# EAGLE design oplab_pth (EAGLE 9.4.2)

## Sheet 1 of 3
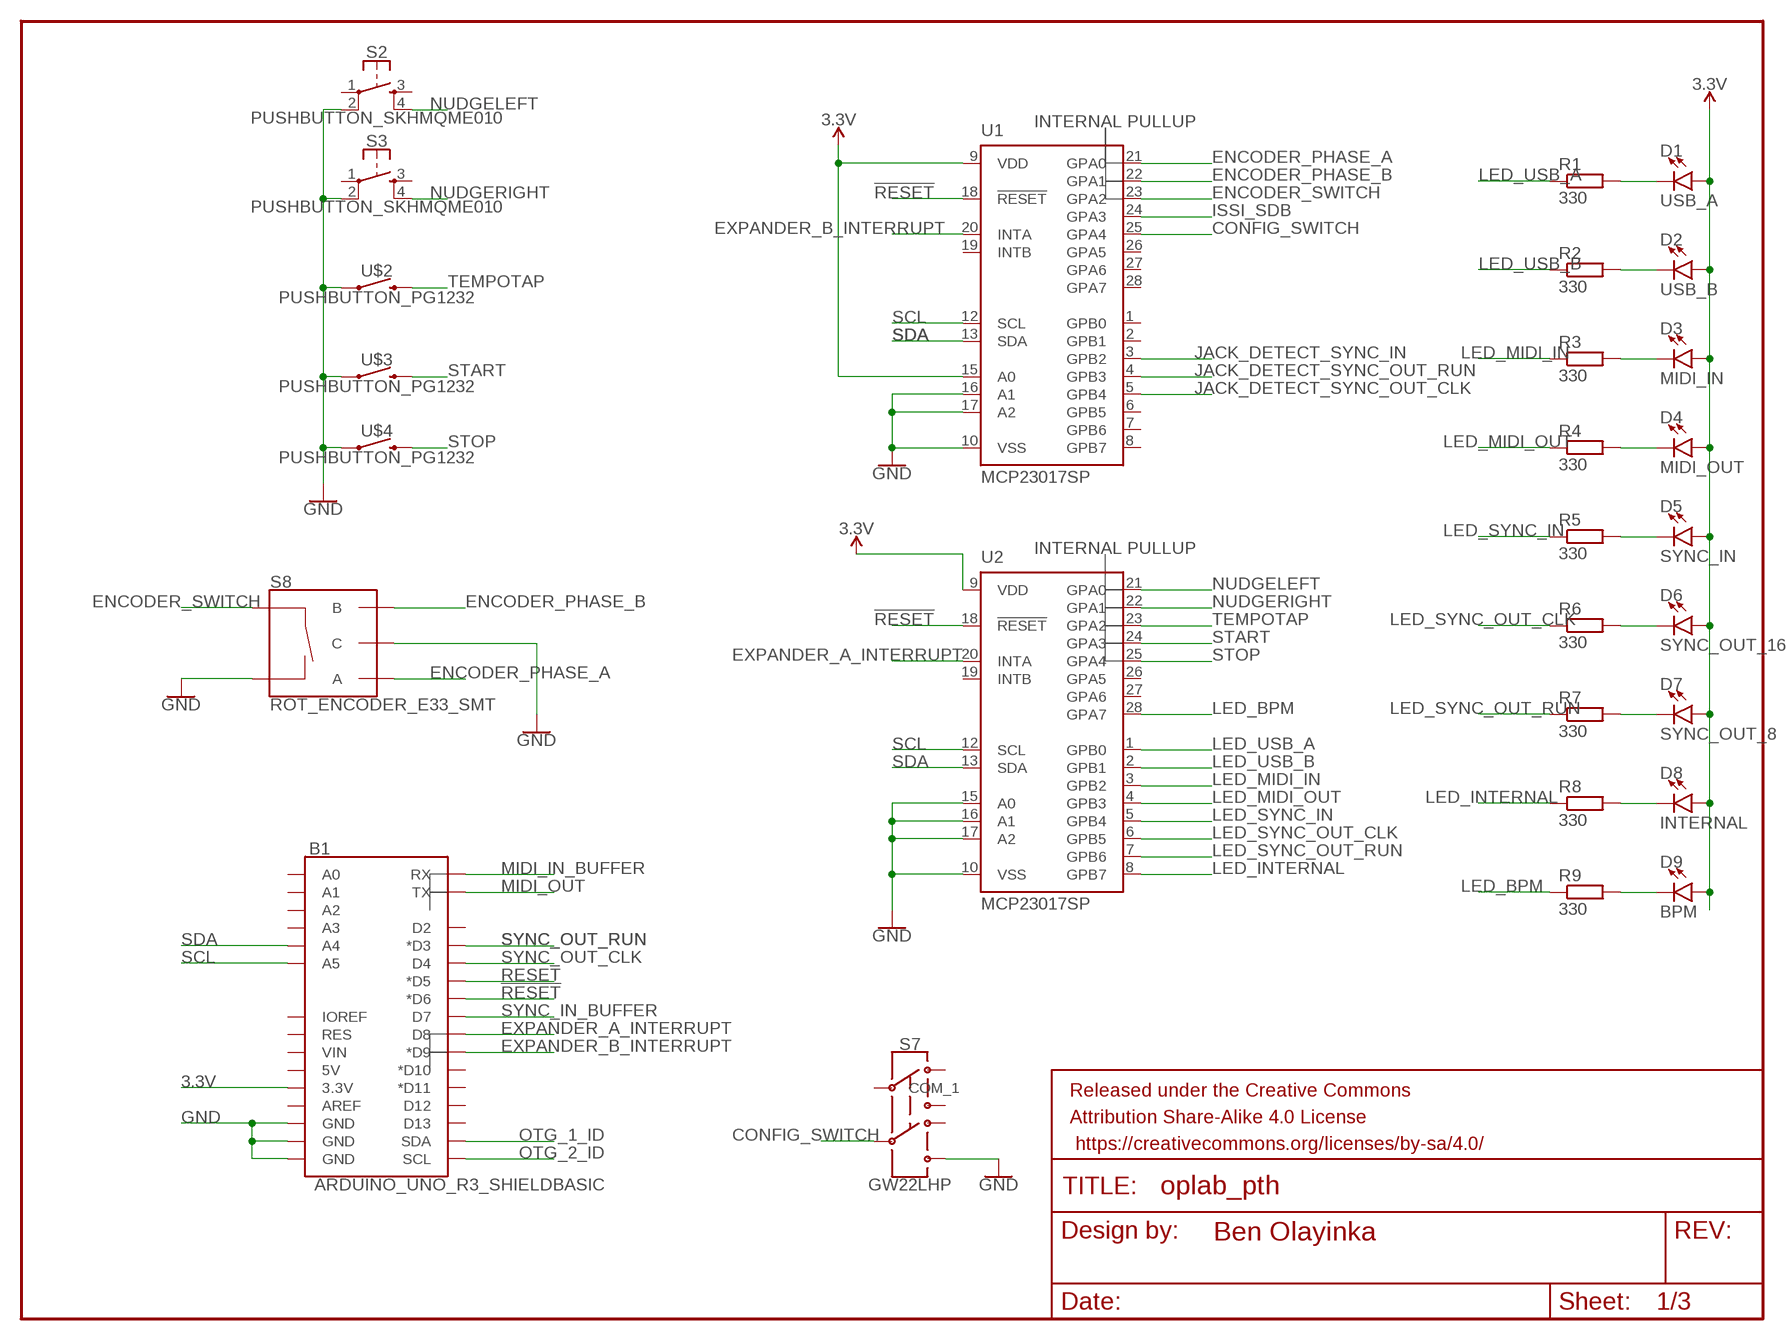
[diagram p0: schematic, sheet 1]

### Parts
B1  ARDUINO_UNO_R3_SHIELDBASIC  [UNO_R3_SHIELD]
D1  USB_A  LED5MM  [LED_5MM]
D2  USB_B  LED5MM  [LED_5MM]
D3  MIDI_IN  LED5MM  [LED_5MM]
D4  MIDI_OUT  LED5MM  [LED_5MM]
D5  SYNC_IN  LED5MM  [LED_5MM]
D6  SYNC_OUT_16  LED5MM  [LED_5MM]
D7  SYNC_OUT_8  LED5MM  [LED_5MM]
D8  INTERNAL  LED5MM  [LED_5MM]
D9  BPM  LED5MM  [LED_5MM]
FRAME1  FRAME-LETTERNO_PACKAGE  [DUMMY]
R1  330  R-EU_0207/10  [0207/10]
R2  330  R-EU_0207/10  [0207/10]
R3  330  R-EU_0207/10  [0207/10]
R4  330  R-EU_0207/10  [0207/10]
R5  330  R-EU_0207/10  [0207/10]
R6  330  R-EU_0207/10  [0207/10]
R7  330  R-EU_0207/10  [0207/10]
R8  330  R-EU_0207/10  [0207/10]
R9  330  R-EU_0207/10  [0207/10]
S2  PUSHBUTTON_SKHMQME010  [PUSHUTTON_SKHMQLE010]
S3  PUSHBUTTON_SKHMQME010  [PUSHUTTON_SKHMQLE010]
S7  GW22LHP  [GW22LHP]
S8  ROT_ENCODER_E33_SMT  [ROT_ENCODER_E33_SMT]
U1  MCP23017SP  [DIL28-3]
U2  MCP23017SP  [DIL28-3]
U$2  PUSHBUTTON_PG1232  [PUSHBUTTON_PG1232]
U$3  PUSHBUTTON_PG1232  [PUSHBUTTON_PG1232]
U$4  PUSHBUTTON_PG1232  [PUSHBUTTON_PG1232]

### Nets
3.3V: B1.3.3V D1.A D2.A D3.A D4.A D5.A D6.A D7.A D8.A D9.A U1.9(VDD) U1.15(A0) U2.9(VDD) ; also sheet 2
!RESET: B1.D6(*D6) U1.18(!RESET) U2.18(!RESET)
CONFIG_SWITCH: S7.5(COM_2) U1.25(GPA4)
ENCODER_PHASE_A: S8.A U1.21(GPA0)
ENCODER_PHASE_B: S8.B U1.22(GPA1)
ENCODER_SWITCH: S8.S1(SW+) U1.23(GPA2)
EXPANDER_A_INTERRUPT: B1.D8 U2.20(INTA)
EXPANDER_B_INTERRUPT: B1.D9(*D9) U1.20(INTA)
GND: B1.GND@0(GND) B1.GND@1(GND) B1.GND@2(GND) S2.2 S3.2 S7.4(NO_2) S8.C S8.S2(SW-) U1.10(VSS) U1.16(A1) U1.17(A2) U2.10(VSS) U2.15(A0) U2.16(A1) U2.17(A2) U$2.1 U$3.1 U$4.1 ; also sheet 2
ISSI_SDB: U1.24(GPA3) ; also sheet 2
JACK_DETECT_SYNC_IN: U1.3(GPB2) ; also sheet 2
JACK_DETECT_SYNC_OUT_CLK: U1.5(GPB4) ; also sheet 2
JACK_DETECT_SYNC_OUT_RUN: U1.4(GPB3) ; also sheet 2
LED_BPM: R9.1 U2.28(GPA7)
LED_INTERNAL: R8.1 U2.8(GPB7)
LED_MIDI_IN: R3.1 U2.3(GPB2)
LED_MIDI_OUT: R4.1 U2.4(GPB3)
LED_SYNC_IN: R5.1 U2.5(GPB4)
LED_SYNC_OUT_CLK: R6.1 U2.6(GPB5)
LED_SYNC_OUT_RUN: R7.1 U2.7(GPB6)
LED_USB_A: R1.1 U2.1(GPB0)
LED_USB_B: R2.1 U2.2(GPB1)
MIDI_IN_BUFFER: B1.RX ; also sheet 2
MIDI_OUT: B1.TX ; also sheet 2
N$1: D1.K(C) R1.2
N$2: D2.K(C) R2.2
N$3: D3.K(C) R3.2
N$4: D4.K(C) R4.2
N$5: D5.K(C) R5.2
N$6: D6.K(C) R6.2
N$7: D7.K(C) R7.2
N$9: D8.K(C) R8.2
N$10: D9.K(C) R9.2
NUDGELEFT: S2.4 U2.21(GPA0)
NUDGERIGHT: S3.4 U2.22(GPA1)
OTG_1_ID: B1.SDA
OTG_2_ID: B1.SCL
RESET: B1.D5(*D5) ; also sheet 2
SCL: B1.A5 U1.12(SCL) U2.12(SCL) ; also sheet 2
SDA: B1.A4 U1.13(SDA) U2.13(SDA) ; also sheet 2
START: U2.24(GPA3) U$3.2
STOP: U2.25(GPA4) U$4.2
SYNC_IN_BUFFER: B1.D7 ; also sheet 2
SYNC_OUT_CLK: B1.D4 ; also sheet 2
SYNC_OUT_RUN: B1.D3(*D3) ; also sheet 2
TEMPOTAP: U2.23(GPA2) U$2.2
Unconnected: B1.5V B1.A0 B1.A1 B1.A2 B1.A3 B1.AREF B1.D2 B1.D10(*D10) B1.D11(*D11) B1.D12 B1.D13 B1.IOREF B1.RES B1.VIN S2.1 S2.3 S3.1 S3.3 S7.1(NO_1) S7.2(COM_1) S7.3(NC_1) S7.6(NC_2) U1.1(GPB0) U1.2(GPB1) U1.6(GPB5) U1.7(GPB6) U1.8(GPB7) U1.19(INTB) U1.26(GPA5) U1.27(GPA6) U1.28(GPA7) U2.19(INTB) U2.26(GPA5) U2.27(GPA6)

### Notes on the sheet
- INTERNAL PULLUP
- INTERNAL PULLUP

## Sheet 2 of 3
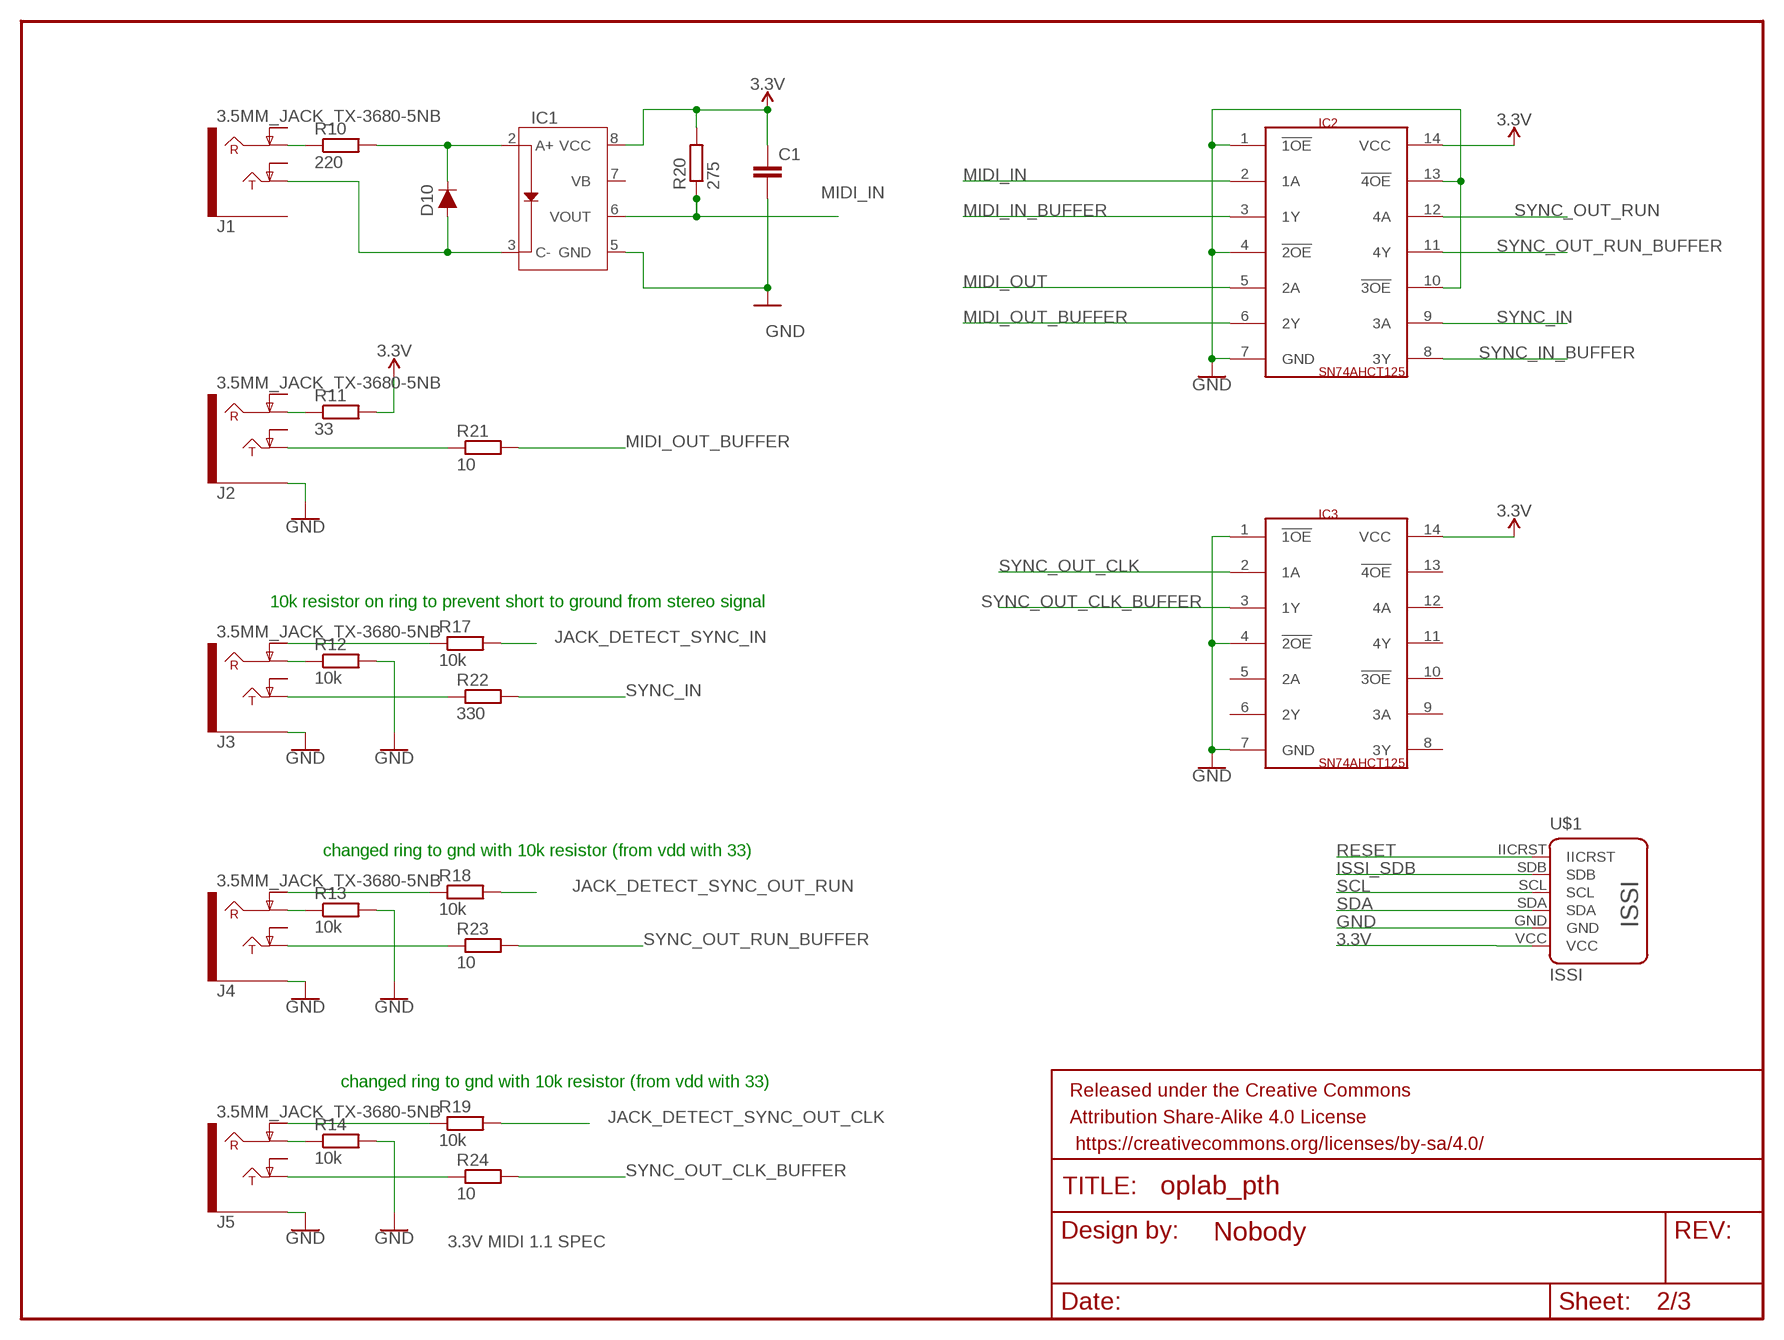
[diagram p1: schematic, sheet 2]

### Parts
C1  C-EU025-024X044  [C025-024X044]
D10  200mA/100V/1V  DIODE-1N4148  [DIODE-1N4148]
FRAME2  FRAME-LETTERNO_PACKAGE  [DUMMY]
IC1  OPTO_DARLINGTON_HCPL0701  [OPTO_DARLINGTON_SOIC127P594X363-8N]
IC2  SN74AHCT125  [SN74AHCT_DIP794W53P254L1930H508Q14N]
IC3  SN74AHCT125  [SN74AHCT_DIP794W53P254L1930H508Q14N]
J1  3.5MM_JACK_TX-3680-5NB  [3.5MM_JACK_TX36805NB]
J2  3.5MM_JACK_TX-3680-5NB  [3.5MM_JACK_TX36805NB]
J3  3.5MM_JACK_TX-3680-5NB  [3.5MM_JACK_TX36805NB]
J4  3.5MM_JACK_TX-3680-5NB  [3.5MM_JACK_TX36805NB]
J5  3.5MM_JACK_TX-3680-5NB  [3.5MM_JACK_TX36805NB]
R10  220  R-EU_0207/10  [0207/10]
R11  33  R-EU_0207/10  [0207/10]
R12  10k  R-EU_0207/10  [0207/10]
R13  10k  R-EU_0207/10  [0207/10]
R14  10k  R-EU_0207/10  [0207/10]
R17  10k  R-EU_0207/10  [0207/10]
R18  10k  R-EU_0207/10  [0207/10]
R19  10k  R-EU_0207/10  [0207/10]
R20  275  R-EU_0207/10  [0207/10]
R21  10  R-EU_0207/10  [0207/10]
R22  330  R-EU_0207/10  [0207/10]
R23  10  R-EU_0207/10  [0207/10]
R24  10  R-EU_0207/10  [0207/10]
U$1  ISSI  [ISSI]

### Nets
3.3V: C1.1 IC1.8(VCC) IC2.14(VCC) IC3.14(VCC) R11.2 R20.2 U$1.VCC ; also sheet 1
GND: C1.2 IC1.5(GND) IC2.1(!1OE) IC2.4(!2OE) IC2.7(GND) IC2.10(!3OE) IC2.13(!4OE) IC3.1(!1OE) IC3.4(!2OE) IC3.7(GND) J2.1.EARTH(EARTH) J3.1.EARTH(EARTH) J4.1.EARTH(EARTH) J5.1.EARTH(EARTH) R12.2 R13.2 R14.2 U$1.GND ; also sheet 1
ISSI_SDB: U$1.SDB ; also sheet 1
JACK_DETECT_SYNC_IN: R17.2 ; also sheet 1
JACK_DETECT_SYNC_OUT_CLK: R19.2 ; also sheet 1
JACK_DETECT_SYNC_OUT_RUN: R18.2 ; also sheet 1
MIDI_IN: IC1.6(VOUT) IC2.2(1A) R20.1
MIDI_IN_BUFFER: IC2.3(1Y) ; also sheet 1
MIDI_OUT: IC2.5(2A) ; also sheet 1
MIDI_OUT_BUFFER: IC2.6(2Y) R21.2
N$8: D10.C IC1.2(A+) R10.2
N$11: D10.A IC1.3(C-) J1.2.TIP(TIP)
N$12: J1.3.RING(RING) R10.1
N$13: J2.3.RING(RING) R11.1
N$14: J3.3.RING(RING) R12.1
N$15: J4.3.RING(RING) R13.1
N$16: J5.3.RING(RING) R14.1
N$21: J2.2.TIP(TIP) R21.1
N$23: J3.2.TIP(TIP) R22.1
N$25: J4.2.TIP(TIP) R23.1
N$27: J5.2.TIP(TIP) R24.1
N$32: J3.5.RINGNORM(RING-NORM) R17.1
N$33: J4.5.RINGNORM(RING-NORM) R18.1
N$34: J5.5.RINGNORM(RING-NORM) R19.1
RESET: U$1.IICRST ; also sheet 1
SCL: U$1.SCL ; also sheet 1
SDA: U$1.SDA ; also sheet 1
SYNC_IN: IC2.9(3A) R22.2
SYNC_IN_BUFFER: IC2.8(3Y) ; also sheet 1
SYNC_OUT_CLK: IC3.2(1A) ; also sheet 1
SYNC_OUT_CLK_BUFFER: IC3.3(1Y) R24.2
SYNC_OUT_RUN: IC2.12(4A) ; also sheet 1
SYNC_OUT_RUN_BUFFER: IC2.11(4Y) R23.2
Unconnected: IC1.7(VB) IC3.5(2A) IC3.6(2Y) IC3.8(3Y) IC3.9(3A) IC3.10(!3OE) IC3.11(4Y) IC3.12(4A) IC3.13(!4OE) J1.1.EARTH(EARTH) J1.4.TIPNORM(TIP-NORM) J1.5.RINGNORM(RING-NORM) J2.4.TIPNORM(TIP-NORM) J2.5.RINGNORM(RING-NORM) J3.4.TIPNORM(TIP-NORM) J4.4.TIPNORM(TIP-NORM) J5.4.TIPNORM(TIP-NORM)

### Notes on the sheet
- 10k resistor on ring to prevent short to ground from stereo signal
- changed ring to gnd with 10k resistor (from vdd with 33)
- changed ring to gnd with 10k resistor (from vdd with 33)
- 3.3V MIDI 1.1 SPEC

## Sheet 3 of 3
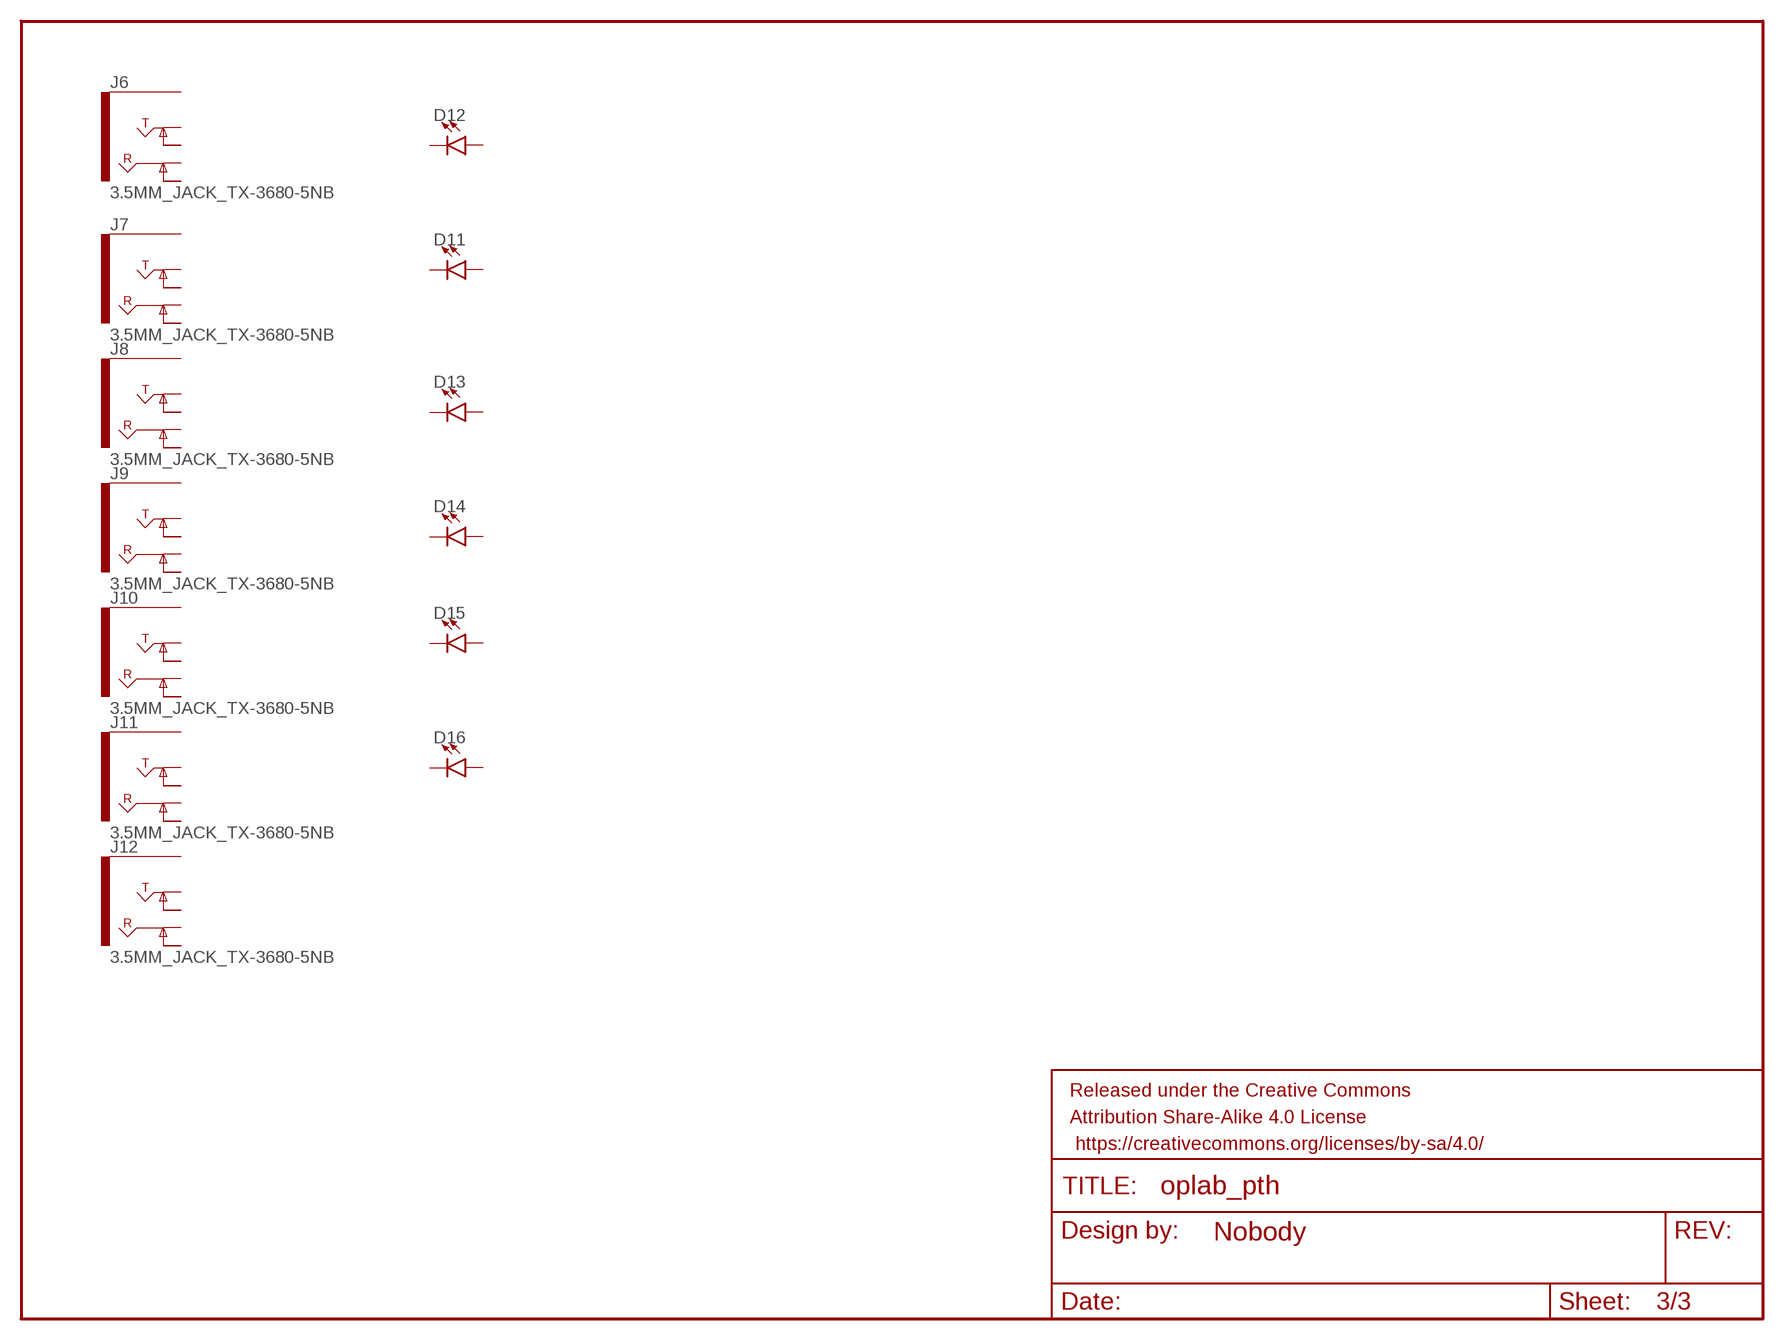
[diagram p2: schematic, sheet 3]

### Parts
D11  LED5MM  [LED_5MM]
D12  LED5MM  [LED_5MM]
D13  LED5MM  [LED_5MM]
D14  LED5MM  [LED_5MM]
D15  LED5MM  [LED_5MM]
D16  LED5MM  [LED_5MM]
FRAME3  FRAME-LETTERNO_PACKAGE  [DUMMY]
J6  3.5MM_JACK_TX-3680-5NB  [3.5MM_JACK_TX36805NB]
J7  3.5MM_JACK_TX-3680-5NB  [3.5MM_JACK_TX36805NB]
J8  3.5MM_JACK_TX-3680-5NB  [3.5MM_JACK_TX36805NB]
J9  3.5MM_JACK_TX-3680-5NB  [3.5MM_JACK_TX36805NB]
J10  3.5MM_JACK_TX-3680-5NB  [3.5MM_JACK_TX36805NB]
J11  3.5MM_JACK_TX-3680-5NB  [3.5MM_JACK_TX36805NB]
J12  3.5MM_JACK_TX-3680-5NB  [3.5MM_JACK_TX36805NB]
Unconnected: D11.A D11.K(C) D12.A D12.K(C) D13.A D13.K(C) D14.A D14.K(C) D15.A D15.K(C) D16.A D16.K(C) J6.1.EARTH(EARTH) J6.2.TIP(TIP) J6.3.RING(RING) J6.4.TIPNORM(TIP-NORM) J6.5.RINGNORM(RING-NORM) J7.1.EARTH(EARTH) J7.2.TIP(TIP) J7.3.RING(RING) J7.4.TIPNORM(TIP-NORM) J7.5.RINGNORM(RING-NORM) J8.1.EARTH(EARTH) J8.2.TIP(TIP) J8.3.RING(RING) J8.4.TIPNORM(TIP-NORM) J8.5.RINGNORM(RING-NORM) J9.1.EARTH(EARTH) J9.2.TIP(TIP) J9.3.RING(RING) J9.4.TIPNORM(TIP-NORM) J9.5.RINGNORM(RING-NORM) J10.1.EARTH(EARTH) J10.2.TIP(TIP) J10.3.RING(RING) J10.4.TIPNORM(TIP-NORM) J10.5.RINGNORM(RING-NORM) J11.1.EARTH(EARTH) J11.2.TIP(TIP) J11.3.RING(RING) J11.4.TIPNORM(TIP-NORM) J11.5.RINGNORM(RING-NORM) J12.1.EARTH(EARTH) J12.2.TIP(TIP) J12.3.RING(RING) J12.4.TIPNORM(TIP-NORM) J12.5.RINGNORM(RING-NORM)

## Library data of the parts
B1 = SparkFun-Boards:ARDUINO_UNO_R3_SHIELD: Arduino R3 Shield Footprint Shield form compatible with the Arduino Uno R3. SparkFun Products: MG2639 Cellular Shield <https://www.sparkfun.com/products/13120> MIDI Shield <https://www.sparkfun.com/products/12898> R3 Stackable Headers Kit <https://www.sparkfun.com/products/11417>
C1 = rcl:C-EU: CAPACITOR, European symbol; SPICEPREFIX: C
D1-D9 D11-D16 = SparkFun-LED:LED: LED (Generic) Standard schematic elements and footprints for 5mm, 3mm, 1206, and 0603 sized LEDs. Generic LEDs with no color specified.
D10 = SparkFun-DiscreteSemi:DIODE: Diode These are standard reverse protection diodes and small signal diodes. SparkFun Products: SparkFun SparkPunk Sound Kit <https://www.sparkfun.com/products/11177> SparkFun ESP8266 Thing <https://www.sparkfun.com/products/13231>; PROD_ID: DIO-08378
FRAME1 = SparkFun-Aesthetics:FRAME-LETTER: Schematic Frame - Letter Standard 8.5x11 US Letter frame; DESIGNER: Ben Olayinka; VERSION: v01
FRAME2 FRAME3 = SparkFun-Aesthetics:FRAME-LETTER: Schematic Frame - Letter Standard 8.5x11 US Letter frame; DESIGNER: Nobody; VERSION: v01
IC1 = SamacSys_Parts:OPTO_DARLINGTON_HCPL0701: Hi-Gain Split Darlington Optocoupler SO8 Source: Datasheet <http://www.onsemi.com/pub/Collateral/HCPL0731-D.pdf>; DESCRIPTION: Hi-Gain Split Darlington Optocoupler SO8; HEIGHT: 3.63mm; MANUFACTURER_NAME: ON Semiconductor; MANUFACTURER_PART_NUMBER: HCPL0701; MOUSER_PART_NUMBER: 512-HCPL0701; MOUSER_PRICE-STOCK: https://www.mouser.com/Search/Refine.aspx?Keyword=512-HCPL0701; RS_PART_NUMBER: 9034263P; RS_PRICE-STOCK: http://uk.rs-online.com/web/p/products/9034263P
IC2 IC3 = SamacSys_Parts:SN74AHCT125: sn74ahct125n Quadruple Bus Buffer Gates With 3 State Outputs https://www.ti.com/lit/ds/symlink/sn74ahct125.pdf; DESCRIPTION: Hex Schmitt Trigger Inverter SN74HCT14N; HEIGHT: 5.08mm; MANUFACTURER_NAME: Texas Instruments; MANUFACTURER_PART_NUMBER: SN74HCT14N; MOUSER_PART_NUMBER: 595-SN74HCT14N; MOUSER_PRICE-STOCK: https://www.mouser.com/Search/Refine.aspx?Keyword=595-SN74HCT14N; RS_PART_NUMBER: 0526331; RS_PRICE-STOCK: http://uk.rs-online.com/web/p/products/0526331
J1-J12 = SamacSys_Parts:3.5MM_JACK_TX-3680-5NB
R1-R14 R17-R24 = rcl:R-EU_: RESISTOR, European symbol; SPICEPREFIX: R
S2 S3 = SamacSys_Parts:PUSHBUTTON_SKHMQME010
S7 = SamacSys_Parts:GW22LHP: NKK SWITCHES - GW22LHP - ROCKER SWITCH, DPDT, ON-ON Source: Datasheet <https://www.nkkswitches.com/pdf/GW.pdf>; ALLIED_NUMBER: 70365614; ALLIED_PRICE-STOCK: https://www.alliedelec.com/nkkswitches-gw22lhp/70365614/; DESCRIPTION: NKK SWITCHES - GW22LHP - ROCKER SWITCH, DPDT, ON-ON; HEIGHT: 10.8mm; MANUFACTURER_NAME: NKK Switches; MANUFACTURER_PART_NUMBER: GW22LHP; MOUSER_PART_NUMBER: 633-GW22LHP; MOUSER_PRICE-STOCK: https://www.mouser.com/Search/Refine.aspx?Keyword=633-GW22LHP
S8 = SamacSys_Parts:ROT_ENCODER_E33_SMT: Rotary Switch 16Pos, E33-VT632-M11T, Elma Source: Datasheet <https://www.distrelec.de/en/rotary-switch-16pos-elma-e33-vt632-m11t/p/13584701?utm_source=octoX&utm_medium=cse&utm_campaign=octo-feed&ext_cid=ceoctaqzzen-na>
U1 U2 = adafruit:MCP23017: http://ww1.microchip.com/downloads/en/DeviceDoc/21952a.pdf Source: http://ww1.microchip.com/downloads/en/DeviceDoc/21952a.pdf
U$1 = SamacSys_Parts:ISSI
U$2-U$4 = SamacSys_Parts:PUSHBUTTON_PG1232

## Board
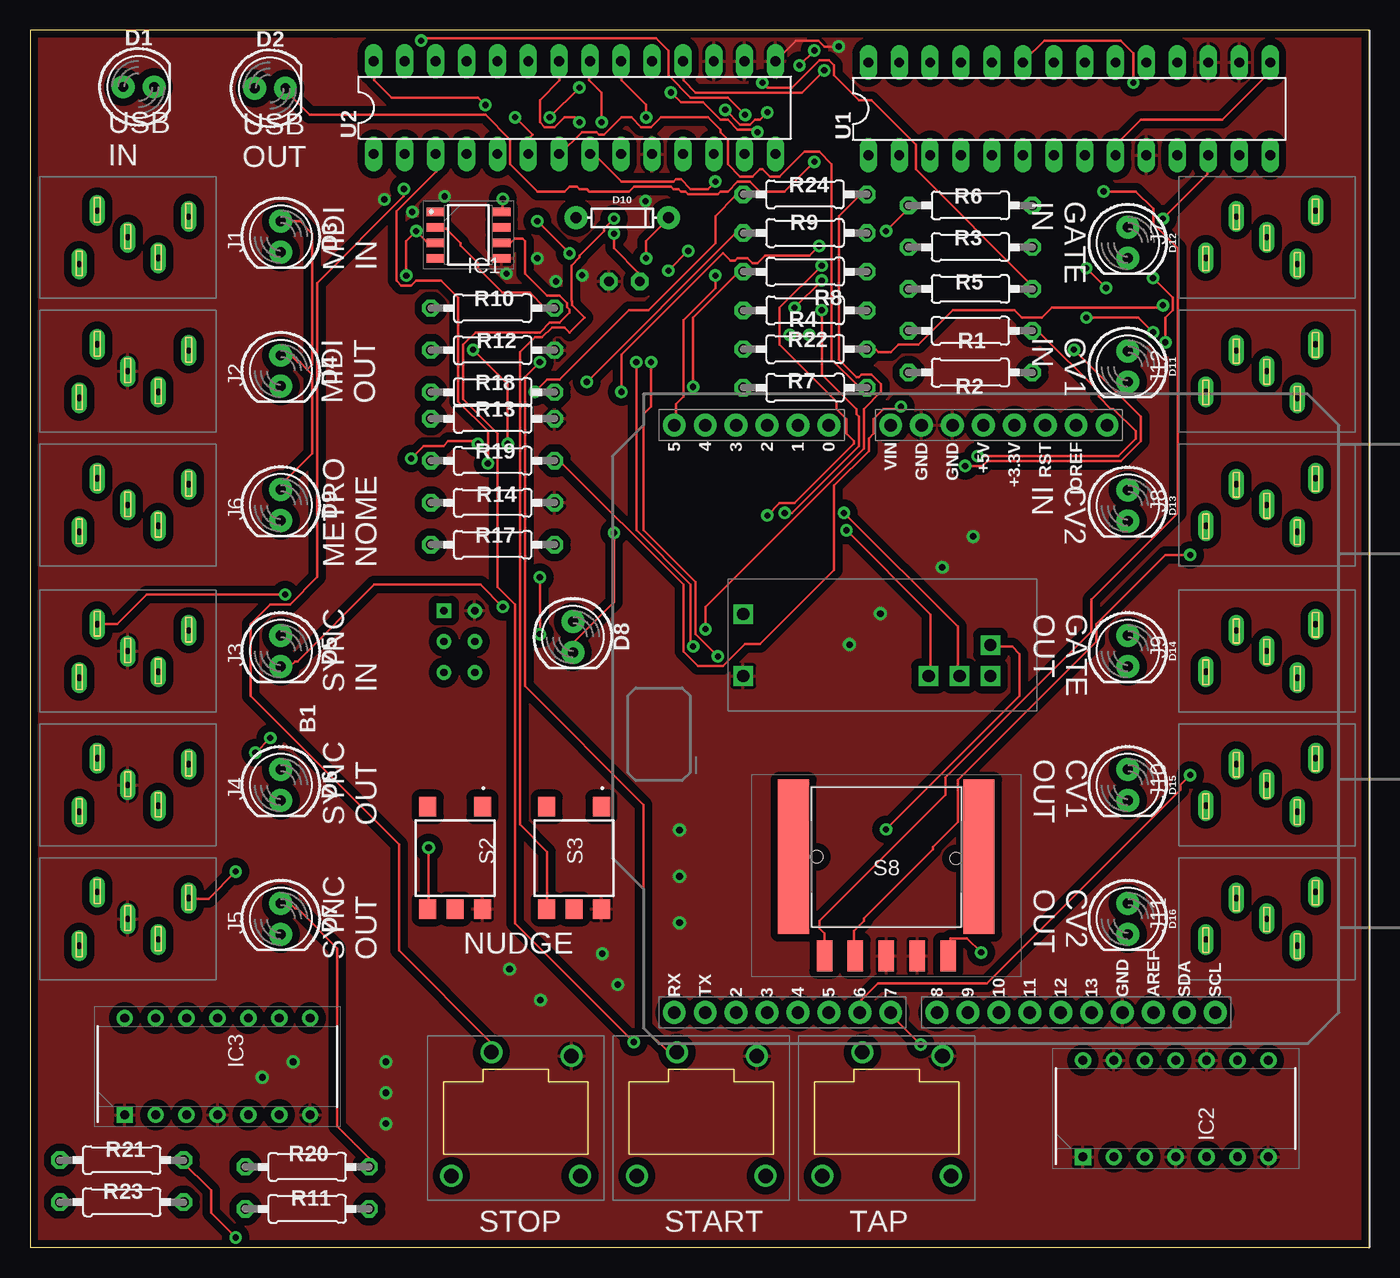
[diagram p3: board, top side]
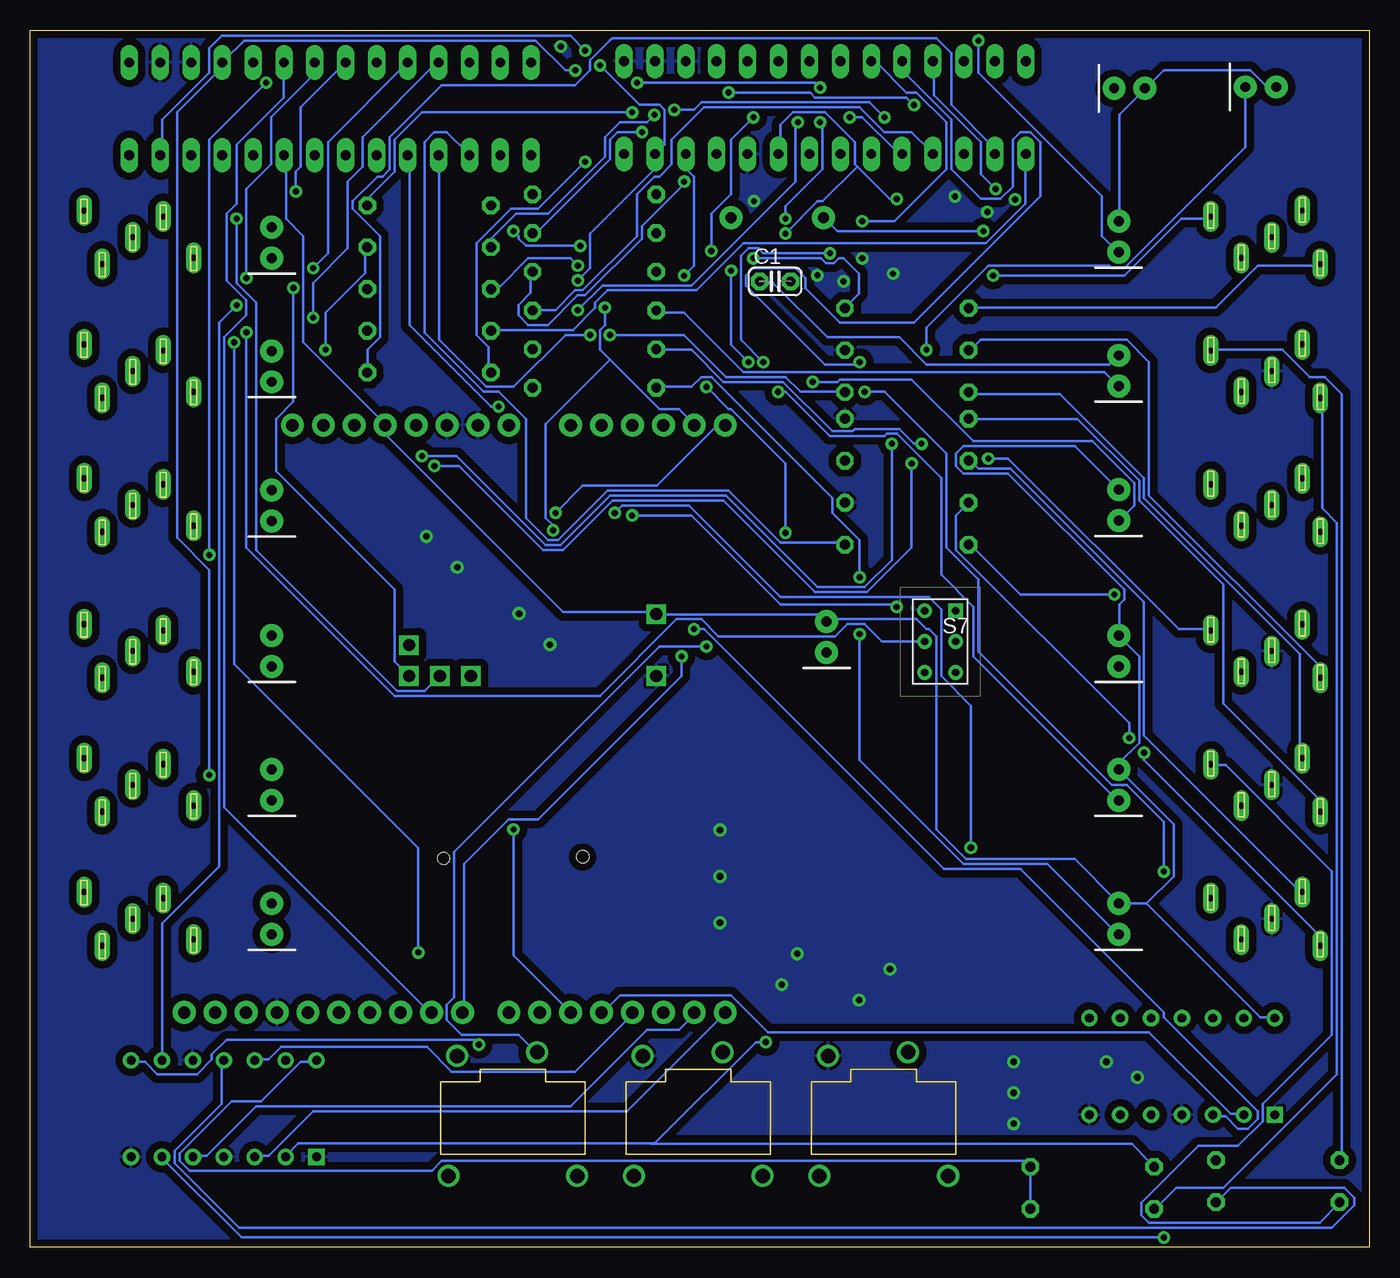
[diagram p4: board, bottom side, seen from below]

Size 110 x 100 mm. Coordinates in mm from the lower left corner, seen from the top.
Outline: 0,0 25,0 110,0 110,100 25,100 0,100 0,0
Copper layers (1*16): Top 0.035mm / dielectric 1.5mm / Bottom 0.035mm
Design rules "SparkFun": minimum track width 8mil, minimum drill 20mil, track to track 8mil, track to pad 8mil, pad to pad 8mil, via to via 8mil, smd to smd 8mil, copper to edge 8mil, drill to drill 8mil, minimum pad ring 12mil, minimum via ring 10mil, stop-mask expansion 4mil, vias tented up to drill 20mil, thermal gap 10mil

### Footprints (pad centres in the part's own frame; a part is rotated, then mirrored left to right if it is on the bottom)
UNO_R3_SHIELD = drill 1.016 pad 1.88: 3.3V 24.13,-2.54; 5V 24.13,0; A0 24.13,12.7; A1 24.13,15.24; A2 24.13,17.78; A3 24.13,20.32; A4 24.13,22.86; A5 24.13,25.4; AREF -24.13,-13.97; D2 -24.13,20.32; D3 -24.13,17.78; D4 -24.13,15.24; D5 -24.13,12.7; D6 -24.13,10.16; D7 -24.13,7.62; D8 -24.13,3.81; D9 -24.13,1.27; D10 -24.13,-1.27; D11 -24.13,-3.81; D12 -24.13,-6.35; D13 -24.13,-8.89; GND@0 24.13,2.54; GND@1 24.13,5.08; GND@2 -24.13,-11.43; IOREF 24.13,-7.62; NC 24.13,-10.16; RES 24.13,-5.08; RX -24.13,25.4; SCL -24.13,-19.05; SDA -24.13,-16.51; TX -24.13,22.86; VIN 24.13,7.62
C025-024X044 = drill 0.813 octagon: 1 -1.27,0; 2 1.27,0
LED_5MM = drill 0.813 pad 1.88: A -1.27,0; K 1.27,0
DIODE-1N4148 = drill 0.9 pad 1.88: A -3.81,0; C 3.81,0
OPTO_DARLINGTON_SOIC127P594X363-8N = smd 1.45 x 0.7: 1 -2.725,1.905; 2 -2.725,0.635; 3 -2.725,-0.635; 4 -2.725,-1.905; 5 2.725,-1.905; 6 2.725,-0.635; 7 2.725,0.635; 8 2.725,1.905
SN74AHCT_DIP794W53P254L1930H508Q14N = drill 0.73 pad 1.13 square: 1 -3.97,7.62 | drill 0.73 pad 1.13: 2 -3.97,5.08; 3 -3.97,2.54; 4 -3.97,0; 5 -3.97,-2.54; 6 -3.97,-5.08; 7 -3.97,-7.62; 8 3.97,-7.62; 9 3.97,-5.08; 10 3.97,-2.54; 11 3.97,0; 12 3.97,2.54; 13 3.97,5.08; 14 3.97,7.62
3.5MM_JACK_TX36805NB = drill 0.508 pad 1.27 long: 1.EARTH 0,0; 2.TIP -1.7,5; 3.RING 2.2,-4; 4.TIPNORM 1.7,2.5; 5.RINGNORM -2.2,-2.5
0207/10 = drill 0.813 octagon: 1 -5.08,0; 2 5.08,0
PUSHUTTON_SKHMQLE010 = smd 1.6 x 1.4: 1 -4.2,2.25; 2 4.2,2.25; 3 -4.2,-2.25; 4 4.2,-2.25; 5 4.2,0
GW22LHP = drill 0.6 pad 1 square: 1 0,0 | drill 0.6 pad 1: 2 0,-2.54; 3 0,-5.08; 4 -2.54,0; 5 -2.54,-2.54; 6 -2.54,-5.08
ROT_ENCODER_E33_SMT = smd 1.27 x 2.54: A 5.08,-8.128; B -5.08,-8.128; C 2.54,-8.128; S1 -2.54,-8.128; S2 0,-8.128 | smd 2.54 x 12.7: P$6 -7.62,0; P$8 7.62,0 | hole 1: -5.715,0; 5.715,-0.127
DIL28-3 = drill 0.813 long: 1 -16.51,-3.81; 2 -13.97,-3.81; 3 -11.43,-3.81; 4 -8.89,-3.81; 5 -6.35,-3.81; 6 -3.81,-3.81; 7 -1.27,-3.81; 8 1.27,-3.81; 9 3.81,-3.81; 10 6.35,-3.81; 11 8.89,-3.81; 12 11.43,-3.81; 13 13.97,-3.81; 14 16.51,-3.81; 15 16.51,3.81; 16 13.97,3.81; 17 11.43,3.81; 18 8.89,3.81; 19 6.35,3.81; 20 3.81,3.81; 21 1.27,3.81; 22 -1.27,3.81; 23 -3.81,3.81; 24 -6.35,3.81; 25 -8.89,3.81; 26 -11.43,3.81; 27 -13.97,3.81; 28 -16.51,3.81
ISSI = drill 1 square: GND -11.43,-2.54; IICRST 8.89,0; SCL 6.35,-2.54; SDA 3.81,-2.54; SDB 8.89,-2.54; VCC -11.43,2.54
PUSHBUTTON_PG1232 = drill 1.2: 1 4.58,5.1; 2 -2,5.41; NOTCONNECTED3 -5.29,-4.75; NOTCONNECTED4 5.29,-4.75

### Placement (x,y rotation side)
B1  78.31,43.43 90 top
C1  48.8,79.38 0 bottom
D1  8.88,95.36 0 top
D2  19.68,95.24 0 top
D3  20.57,83.06 270 top
D4  20.57,72.03 270 top
D5  20.57,49 270 top
D6  20.57,38 270 top
D7  20.57,27 270 top
D8  44.58,50.16 270 top
D9  20.57,61 270 top
D10  48.63,84.61 0 top
D11  90.17,72.39 270 top
D12  90.17,82.55 270 top
D13  90.17,60.96 270 top
D14  90.17,49 270 top
D15  90.17,38 270 top
D16  90.17,27 270 top
FRAME1  0,0 0 top
FRAME2  29.72,21.02 0 top
FRAME3  -1.27,-2.54 0 top
IC1  35.99,83.19 0 top
IC2  94.11,11.4 90 top
IC3  15.37,14.86 90 top
J1  8,83 270 top
J2  8,72 270 top
J3  8,49 270 top
J4  8,38 270 top
J5  8,27 270 top
J6  8,61 270 top
J7  101.6,83 90 top
J8  101.6,61 90 top
J9  101.6,49 90 top
J10  101.6,38 90 top
J11  101.6,27 90 top
J12  101.6,72 90 top
R1  77.24,75.32 0 top
R2  77.24,71.89 180 top
R3  77.24,82.19 180 top
R4  63.65,76.99 180 top
R5  77.24,78.75 180 top
R6  77.24,85.62 180 top
R7  63.65,70.64 180 top
R8  63.65,80.17 180 top
R9  63.65,83.35 180 top
R10  37.99,77.18 0 top
R11  22.75,3.16 0 top
R12  37.99,73.73 0 top
R13  37.99,68.09 0 top
R14  37.99,61.19 0 top
R17  37.99,57.74 0 top
R18  37.99,70.28 0 top
R19  37.99,64.64 0 top
R20  22.75,6.61 0 top
R21  7.51,7.17 0 top
R22  63.65,73.81 0 top
R23  7.51,3.72 0 top
R24  63.65,86.53 0 top
S2  34.89,32 270 top
S3  44.67,32 270 top
S7  33.97,52.32 0 bottom
S8  70.33,32.09 0 top
U1  85.36,93.56 0 top
U2  44.72,93.66 0 top
U$1  70,49.49 0 top
U$2  70.36,10.62 0 top
U$3  55.12,10.62 0 top
U$4  39.88,10.62 0 top

### Tracks (layer width: path | path; a pad name or v marks a point on that pad's centre or on a via)
3.3V  (via drill 0.51)
  Top 0.203: U1.15 101.8,97.33 101.8,96.52 97.94,92.66 91.24,92.66 89.2,90.63 89.2,89.81 U1.9 | v38.81,86.16 38.81,85.14 IC1.8 | 22.76,72.14 22.15,72.75 21.95,72.75 21.54,73.15 20.73,73.15 D4.A | 22.76,72.14 23.16,71.73 23.16,65.23 20.73,62.79 20.73,62.38 D9.A | v47.95,83.31 47.95,82.09 49.99,80.06 49.99,79.45 C1.1 | 22.76,72.14 23.16,72.54 23.16,83.31 22.15,84.33 20.73,84.33 D3.A | R20.2 27.84,6.71 27.84,7.32 25.2,9.96 25.2,24.59 21.95,27.84 21.74,27.84 21.34,28.25 20.73,28.25 D7.A
  Bottom 0.203: U1.9 89,89.61 89,84.53 87.58,83.11 87.58,74.37 80.87,67.67 B1.3.3V 80.67,67.46 80.67,66.65 66.24,52.22 58.73,52.22 U$1.VCC 58.52,52.02 45.11,52.02 44.7,51.61 D8.A 44.5,51.61 37.19,51.61 36.37,50.8 36.17,50.8 35.56,50.19 35.56,34.34 33.12,31.9 24.18,31.9 20.73,28.45 D7.A 20.52,28.25 18.29,28.25 | IC2.14 86.56,15.24 87.78,15.24 91.03,11.99 93.47,11.99 97.74,7.72 97.74,7.11 96.93,6.3 77.01,6.3 76.2,7.11 28.25,7.11 27.84,6.71 R20.2 27.84,6.5 27.84,3.25 R11.2 | 18.29,28.25 8.94,18.9 7.92,18.9 IC3.14 | 18.29,28.25 16.05,30.48 16.05,34.75 20.52,39.22 D6.A 20.52,39.42 20.52,39.83 18.9,41.45 18.9,48.56 20.52,50.19 D5.A 20.52,50.39 20.52,52.83 20.12,53.24 20.12,54.05 29.67,63.6 33.33,63.6 33.93,64.21 33.93,65.23 33.33,65.84 24.18,65.84 20.73,62.38 D9.A | D3.A 20.52,84.33 20.52,93.07 18.49,95.1 D2.A 18.29,95.3 16.87,96.72 9.75,96.72 8.53,95.5 7.72,95.5 D1.A | v38.81,86.16 39.42,86.16 42.06,88.8 | 42.06,88.8 42.27,89 42.27,90.83 44.7,93.27 47.35,93.27 48.36,92.25 48.36,90.02 U2.9 | C1.1 49.99,79.25 48.97,79.25 44.5,74.78 38.61,74.78 36.37,72.54 21.34,72.54 20.73,73.15 D4.A | 42.06,88.8 44.91,85.95 45.31,85.95 v47.95,83.31
!RESET  (via drill 0.51)
  Top 0.203: v65.23,96.72 63.4,94.89 54.66,94.89 53.65,95.91 53.65,97.33 U2.18 | v95.3,38.81 94.49,38 94.49,37.59 78.59,21.69 69.65,21.69 68.28,20.32 68.28,19.3 B1.D6
  Bottom 0.203: v65.23,96.72 66.04,96.72 68.48,99.16 92.46,99.16 94.08,97.54 U1.18 94.28,97.33 94.28,96.93 97.94,93.27 97.94,58.32 95.3,55.68 v95.3,38.81
CONFIG_SWITCH  (via drill 0.51)
  Top 0.203: v92.25,75.18 91.03,76.4 v86.77,76.4
  Bottom 0.203: v92.25,75.18 92.25,57.51 80.06,45.31 63.2,45.31 56.9,51.61 54.86,51.61 53.44,50.19 43.89,50.19 42.88,51.21 41.45,51.21 40.03,49.78 36.58,49.78 S7.5 | v86.77,76.4 86.77,79.25 83.92,82.09 83.92,87.58 82.7,88.8 82.7,91.24 76.61,97.33 U1.25
ENCODER_PHASE_A  (via drill 0.51)
  Top 0.203: v78.13,24.23 76.96,25.4 75.59,25.4 S8.A | v93.27,74.37 93.27,76.4 93.88,77.01 93.88,78.03 v92.25,79.65
  Bottom 0.203: v78.13,24.23 78.13,32.82 93.27,47.95 v93.27,74.37 | v92.25,79.65 92.25,86.97 90.22,89 90.22,92.86 86.77,96.32 86.77,97.33 U1.21
ENCODER_PHASE_B  (via drill 0.51)
  Top 0.203: v88.19,86.77 90.83,86.77 92.25,85.34 92.25,84.12 94.28,82.09 94.28,60.35 87.17,53.24 87.17,50.6 75.18,38.61 75.18,37.19 64.82,26.82 64.82,26.21 65.23,25.81 65.23,25.4 S8.B
  Bottom 0.203: v88.19,86.77 88.19,88.39 87.78,88.8 87.78,93.67 84.12,97.33 U1.22
ENCODER_SWITCH  (via drill 0.51)
  Top 0.203: v95.3,56.9 93.27,56.9 87.58,51.21 87.58,49.78 76.2,38.41 76.2,34.95 74.17,32.92 74.17,32.72 68.48,27.03 68.48,26.82 67.67,26.01 67.67,25.4 S8.S1 | v90.63,95.71 90.63,98.15 89.61,99.16 83.31,99.16 81.69,97.54 U1.23
  Bottom 0.203: v95.3,56.9 95.3,91.03 v90.63,95.71
EXPANDER_A_INTERRUPT  (via drill 0.51)
  Top 0.203: v50.6,92.86 50.6,93.88 48.56,95.91 48.56,97.33 U2.20 | v52.43,80.26 v54.05,81.89 | v51,72.75 51,69.09 50.39,68.48 50.39,58.93 54.66,54.66 54.66,50.39 v56.49,48.56
  Bottom 0.203: v50.6,92.86 52.43,91.03 52.43,86.56 54.05,84.94 v54.05,81.89 | v52.43,80.26 52.43,74.17 v51,72.75 | v56.49,48.56 56.49,46.94 68.28,35.15 70.71,35.15 74.37,31.5 74.37,19.3 B1.D8
EXPANDER_B_INTERRUPT
  Bottom 0.203: U1.20 89.2,97.33 89.2,94.49 93.07,90.63 93.07,85.75 93.88,84.94 93.88,79.45 92.25,77.83 92.25,76.61 94.08,74.78 94.08,36.17 77.22,19.3 B1.D9
GND  (via drill 0.51, 0.55)
  Top 0.203: U2.15 62.92,99.16 64.75,99.16 65.23,98.68 v66.42,98.68
  other vias: 46.99,24.13 48.26,21.59 41.91,20.32 39.37,22.86 29.21,15.24 29.21,12.7 29.21,10.16 21.59,15.24 19.05,13.97 53.34,26.67 53.34,30.48 53.34,34.29 69.85,52.07 67.31,49.53 74.93,55.88 77.47,58.42 50.55,85.98 29.08,86.11 45.34,79.88 43.18,79.38 41.66,81.28 39.12,80.01 34.04,86.36 31.37,85.09
  pour Top (isolate 0.61): 0,100 110,100 110,0 0,0
  pour Bottom (isolate 0.61): 0,100 110,100 110,0 0,0
ISSI_SDB  (via drill 0.51)
  Top 0.203: v88.39,78.84 v86.77,80.47
  Bottom 0.203: v86.77,80.47 85.55,81.69 85.55,90.83 79.05,97.33 U1.24 | v88.39,78.84 88.39,69.49 89.81,68.07 89.81,63.8 80.06,54.05 80.06,48.16 79.05,47.14 U$1.SDB
JACK_DETECT_SYNC_IN
  Bottom 0.203: R17.2 43.08,57.91 48.36,57.91 52.63,62.18 62.59,62.18 66.65,58.12 67.46,58.12 69.29,59.94 69.29,68.07 71.53,70.31 72.75,70.31 77.62,75.18 77.62,90.83 76.81,91.64 75.79,91.64 73.97,89.81 U1.3
JACK_DETECT_SYNC_OUT_CLK  (via drill 0.51)
  Top 0.203: v71.53,69.09 71.32,68.89 70.1,68.89 69.29,68.07 69.29,66.85 68.89,66.45 68.89,65.43 66.04,62.59 66.04,55.68 59.94,49.58 58.73,49.58 56.9,47.75 54.86,47.75 53.65,48.97 53.65,54.46 43.48,64.62 43.08,64.62 R19.2
  Bottom 0.203: v71.53,69.09 72.14,69.09 78.84,75.79 78.84,89.61 U1.5
JACK_DETECT_SYNC_OUT_RUN  (via drill 0.51)
  Top 0.203: v64.01,74.98 v62.38,74.98
  Bottom 0.203: v62.38,74.98 56.29,74.98 52.83,71.53 47.95,71.53 46.74,70.31 43.08,70.31 R18.2 | v64.01,74.98 66.04,74.98 70.31,70.71 72.54,70.71 76.4,74.57 76.4,89.61 U1.4
LED_BPM  (via drill 0.51)
  Top 0.203: v59.74,91.64 59.54,91.85 58.12,91.85 57.3,92.66 56.69,92.66 55.27,94.08 53.44,94.08 v52.63,94.89 | v37.39,93.88 36.78,94.49 29.67,94.49 28.25,95.91 28.25,97.33 U2.28
  Bottom 0.203: v59.74,91.64 61.77,91.64 62.38,91.03 62.38,89.41 68.28,83.52 68.68,83.52 R9.1 | v52.63,94.89 45.92,94.89 45.52,94.49 38,94.49 v37.39,93.88
LED_INTERNAL  (via drill 0.51)
  Top 0.203: v56.29,87.58 55.68,86.97 54.25,86.97 53.44,87.78 53.03,87.78 52.83,87.58 48.56,87.58 46.13,90.02 U2.8
  Bottom 0.203: v56.29,87.58 56.29,87.38 59.74,83.92 59.74,82.91 64.41,78.23 65.02,78.23 67.46,75.79 69.09,75.79 69.9,76.61 69.9,77.42 68.89,78.44 68.89,80.06 R8.1
LED_MIDI_IN  (via drill 0.51)
  Top 0.203: v85.75,73.76 91.24,68.28 91.24,66.24 89.61,64.62 78.64,64.62 78.23,64.21 v76.81,64.21 | v37.59,64.41 37.59,67.06 35.15,69.49 35.15,78.03 33.73,79.45 31.7,79.45 31.29,79.05 30.48,79.05 30.07,79.45 30.07,85.14 33.33,88.39 33.33,89.81 U2.3
  Bottom 0.203: v85.75,73.76 85.75,76.81 82.5,80.06 82.5,82.09 R3.1 | v76.81,64.21 74.78,64.21 67.87,57.3 66.24,57.3 62.18,61.37 53.03,61.37 45.52,53.85 41.25,53.85 37.59,57.51 v37.59,64.41
LED_MIDI_OUT
  Bottom 0.203: R4.1 68.68,77.01 66.85,77.01 65.23,78.64 64.62,78.64 60.15,83.11 60.15,86.56 58.73,87.99 58.32,87.99 57.3,89 57.3,91.03 54.66,93.67 41.86,93.67 39.83,91.64 37.59,91.64 35.97,90.02 U2.4
LED_SYNC_IN  (via drill 0.51)
  Top 0.203: v60.15,95.71 60.55,95.3 62.59,95.3 64.82,97.54 65.63,97.54 66.04,97.13 66.04,96.32 68.07,94.28 69.09,94.28 72.75,90.63 72.75,88.59 82.3,79.05 82.3,78.84 R5.1 | v42.67,92.86 v45.11,95.3
  Bottom 0.203: v60.15,95.71 45.52,95.71 v45.11,95.3 | v42.67,92.86 41.66,92.86 38.81,90.02 38.41,90.02 U2.5
LED_SYNC_OUT_CLK  (via drill 0.51)
  Top 0.203: v60.55,93.27 59.94,92.66 59.54,92.66 59.13,92.25 58.32,92.25 v57.1,93.47 | v39.83,92.86 41.25,91.44 41.05,91.24 41.05,90.02 U2.6
  Bottom 0.203: v60.55,93.27 77.83,93.27 80.06,91.03 80.06,88.39 82.3,86.16 82.3,85.75 R6.1 | v57.1,93.47 55.47,93.47 54.86,94.08 41.05,94.08 v39.83,92.86
LED_SYNC_OUT_RUN
  Top 0.203: R7.1 68.68,70.71 68.07,70.71 65.84,72.95 65.84,89 64.82,90.02 63.6,90.02 61.57,87.99 60.76,87.99 60.15,88.59 59.94,88.59 59.33,87.99 58.32,87.99 57.3,89 57.3,91.03 56.69,91.64 56.69,91.85 55.68,92.86 51.82,92.86 51,92.05 50.19,92.05 49.38,92.86 48.56,92.86 47.14,91.44 46.74,91.44 46.53,91.64 45.31,91.64 43.48,89.81 U2.7
LED_USB_A
  Bottom 0.203: R1.1 72.14,75.39 65.43,75.39 63.6,77.22 63.6,77.62 62.59,78.64 55.27,78.64 51.41,82.5 31.5,82.5 28.25,85.75 28.25,89.81 U2.1
LED_USB_B
  Bottom 0.203: R2.1 82.3,71.93 82.3,73.76 81.28,74.78 81.28,83.11 83.52,85.34 83.52,85.95 81.48,87.99 81.08,87.99 80.47,88.59 80.47,91.24 76.2,95.5 65.23,95.5 64.01,96.72 64.01,97.54 62.36,99.19 62.18,99.36 35.56,99.36 34.34,98.15 34.34,93.88 30.89,90.42 30.89,90.02 U2.2
MIDI_IN  (via drill 0.51)
  Top 0.203: v49.58,16.87 39.83,26.62 39.83,52.83 38.41,54.25 38.41,66.85 35.56,69.7 35.56,74.17 36.58,75.18 41.86,75.18 42.67,76 43.48,76 44.3,76.81 44.3,77.05 44.08,77.26 44.08,77.47 | IC1.6 38.81,82.5 39.42,82.5 39.83,82.91 40.44,82.91 40.64,82.7 40.64,80.01 42.45,78.19 43.49,78.19 44.08,77.6 | 44.08,77.6 44.08,77.47 | 44.08,77.47 44.08,77.6
  Bottom 0.203: v49.58,16.87 50.39,16.87 58.73,8.53 59,8.53 | 59,8.53 87.99,8.53 89,7.52 IC2.2 | R20.1 18,7 19.5,8.5 59,8.5 59,8.53
MIDI_IN_BUFFER
  Bottom 0.203: IC2.3 91.44,7.52 90.42,7.52 86.77,11.18 60.96,11.18 53.03,19.1 B1.RX
MIDI_OUT
  Bottom 0.203: IC2.5 96.52,7.52 95.5,7.52 91.44,11.58 65.63,11.58 59.33,17.88 56.69,17.88 55.47,19.1 B1.TX
MIDI_OUT_BUFFER  (via drill 0.51)
  Top 0.203: v16.87,0.81 14.83,2.85 14.83,4.67 12.39,7.11 R21.2
  Bottom 0.203: v16.87,0.81 92.66,0.81 99.16,7.32 IC2.6
N$1  (via drill 0.51)
  Top 0.203: v77.83,65.02 89.41,65.02 90.83,66.45 90.83,67.06 89,68.89 88.8,68.89 87.78,69.9 87.78,70.31 82.91,75.18 82.5,75.18 R1.2 | v39.22,66.04 39.22,70.92 v36.37,73.76
  Bottom 0.203: v77.83,65.02 74.98,65.02 67.67,57.71 66.45,57.71 62.38,61.77 52.83,61.77 45.31,54.25 41.45,54.25 39.22,56.49 v39.22,66.04 | v36.37,73.76 36.37,75.59 31.29,80.67 21.34,80.67 21.13,80.47 20.12,80.47 10.16,90.42 10.16,95.3 D1.K
N$2  (via drill 0.51)
  Top 0.203: v64.41,89.2 61.98,86.77 59.94,86.77 59.13,87.58 58.12,87.58 57.3,86.77 56.69,86.77 56.49,86.56 54.05,86.56 53.85,86.77 53.44,86.77 53.24,86.97 52.83,86.97 52.63,87.17 49.58,87.17 49.17,86.77 45.92,86.77 45.72,86.97 45.11,86.97 44.91,87.17 44.3,87.17 43.89,86.77 41.66,86.77 39.42,89 39.42,91.03 37.39,93.07 22.96,93.07 20.93,95.1 D2.K
  Bottom 0.203: v64.41,89.2 68.28,85.34 70.51,85.34 73.36,82.5 73.36,74.98 72.34,73.97 72.34,71.93 R2.2
N$3  (via drill 0.51)
  Top 0.203: v58.73,93.07 57.3,94.49 54.25,94.49 52.43,96.32 52.43,98.35 51.41,99.36 32.31,99.36 v32.11,99.16
  Bottom 0.203: v58.73,93.07 59.33,92.46 61.57,92.46 62.79,91.24 62.79,89.61 67.46,84.94 70.1,84.94 72.14,82.91 72.14,82.3 R3.2 | v32.11,99.16 32.11,96.52 21.95,86.36 21.95,83.11 20.73,81.89 D3.K
N$4
  Bottom 0.203: R4.2 58.52,76.81 56.29,76.81 51.41,71.93 21.74,71.93 20.73,70.92 D4.K
N$5  (via drill 0.51)
  Top 0.203: v65.02,80.67 61.57,77.22 61.57,74.17 66.24,69.49 66.24,68.89 67.06,68.07 67.06,66.85 67.67,66.24 67.67,66.04 62.79,61.16 61.57,61.16 v60.55,60.15 | v38.81,52.63 36.98,54.46 28.25,54.46 21.95,48.16 21.74,48.16 21.34,47.75 20.73,47.75 D5.K
  Bottom 0.203: v65.02,80.67 65.63,81.28 69.09,81.28 71.53,78.84 72.14,78.84 R5.2 | v60.55,60.15 55.68,60.15 48.36,52.83 39.01,52.83 v38.81,52.63
N$6  (via drill 0.51)
  Top 0.203: v70.31,83.52 72.14,85.34 72.14,85.55 R6.2 | v64.82,82.3 64.01,81.48 60.35,81.48 59.74,80.87 59.33,80.87 58.93,81.28 58.12,81.28 57.91,81.08 57.51,81.08 56.9,81.69 48.56,73.36 v48.56,70.31
  Bottom 0.203: v70.31,83.52 69.9,83.11 69.9,82.91 69.29,82.3 v64.82,82.3 | v48.56,70.31 47.95,70.31 44.3,66.65 39.83,66.65 39.62,66.85 38.81,66.85 35.15,63.2 35.15,55.27 32.51,52.63 32.51,48.56 20.73,36.78 D6.K
N$7  (via drill 0.51)
  Top 0.203: v41.86,50.39 v41.86,55.07
  Bottom 0.203: v41.86,55.07 41.86,58.12 44.09,60.35 44.09,61.57 54.05,71.53 54.86,71.53 55.68,70.71 58.52,70.71 R7.2 | v41.86,50.39 41.86,40.03 33.33,31.5 26.42,31.5 20.73,25.81 D7.K
N$8  (via drill 0.51)
  Top 0.203: IC1.2 33.33,83.72 34.14,83.72 35.36,82.5 35.36,82.3 36.78,80.87 36.78,80.47 38.81,78.44 41.05,78.44 42.27,77.22 42.88,77.22 R10.2 | v50.6,81.28 50.6,82.7 52.43,84.53 D10.C
  Bottom 0.203: R10.2 43.08,77.22 41.91,78.38 41.91,80.01 43.18,81.28 43.55,81.28 43.96,80.87 44.63,80.87 45.04,81.28 v50.6,81.28
N$9  (via drill 0.51)
  Top 0.203: v54.46,70.71 54.46,76.4 58.12,80.06 58.52,80.06 R8.2 | v47.95,58.73 47.95,53.03 44.7,49.78 44.7,48.97 D8.K
  Bottom 0.203: v54.46,70.71 52.63,68.89 52.43,68.89 47.95,64.41 v47.95,58.73
N$10  (via drill 0.51)
  Top 0.203: v45.72,71.12 57.91,83.31 58.52,83.31 R9.2
  Bottom 0.203: v45.72,71.12 43.69,71.12 43.48,71.32 37.59,71.32 32.51,66.24 22.76,66.24 19.3,62.79 19.3,60.96 20.52,59.74 D9.K
N$11  (via drill 0.51)
  Top 0.203: IC1.3 33.12,82.7 32.51,82.7 v31.7,83.52 30.89,82.7 v30.89,79.86
  Bottom 0.203: v31.7,83.52 43.69,83.52 44.7,84.53 D10.A | v30.89,79.86 20.12,79.86 15.44,84.53 13.01,84.53 J1.2.TIP
N$12
  Bottom 0.203: J1.3.RING 4.06,80.67 9.14,80.67 12.6,77.22 32.72,77.22 R10.1
N$13
  Bottom 0.203: J2.3.RING 3.86,69.7 3.86,60.76 2.64,59.54 2.64,14.22 11.99,4.88 15.85,4.88 17.48,3.25 R11.1
N$14
  Bottom 0.203: J3.3.RING 4.06,46.94 4.06,47.75 18.09,61.77 18.09,72.75 19.91,74.57 31.9,74.57 32.72,73.76 R12.1
N$15
  Bottom 0.203: J4.3.RING 4.06,35.97 4.06,36.78 11.99,44.7 11.99,54.46 18.9,61.37 18.9,62.99 23.98,68.07 32.72,68.07 R13.1
N$16  (via drill 0.51)
  Top 0.203: v19.71,41.86 v18.49,40.64
  Bottom 0.203: v18.49,40.64 18.49,40.03 4.06,25.6 4.06,24.99 J5.3.RING | v19.71,41.86 19.71,43.08 33.93,57.3 33.93,60.15 32.92,61.16 R14.1
N$21
  Bottom 0.203: J2.2.TIP 12.8,73.76 7.11,73.76 4.88,71.53 3.66,71.53 2.23,70.1 2.23,7.32 R21.1
N$23  (via drill 0.51)
  Top 0.203: v31.29,64.82 32.31,65.84 33.93,65.84 34.34,66.24 36.58,66.24 v36.78,66.04
  Bottom 0.203: v31.29,64.82 29.67,64.82 15.65,50.8 13.01,50.8 J3.2.TIP | v36.78,66.04 37.39,66.04 38.61,67.26 42.27,67.26 42.47,67.06 44.09,67.06 48.16,71.12 53.03,71.12 55.68,73.76 58.52,73.76 R22.1
N$25
  Bottom 0.203: J4.2.TIP 12.8,39.62 11.79,39.62 3.05,30.89 3.05,17.48 8.74,11.79 8.74,10.36 10.77,8.33 14.02,8.33 18.69,3.66 18.69,2.64 18.09,2.03 4.06,2.03 2.44,3.66 R23.1
N$27  (via drill 0.51)
  Top 0.203: v16.87,30.89 14.63,28.65 13.01,28.65 J5.2.TIP | v41.45,70.31 42.47,71.32 43.48,71.32 49.17,77.01 50.8,77.01 56.29,82.5 56.29,84.73 57.91,86.36 58.52,86.36 R24.1
  Bottom 0.203: v16.87,30.89 16.87,34.95 19.91,38 21.13,38 32.11,48.97 32.11,54.86 34.75,57.51 34.75,65.23 39.83,70.31 v41.45,70.31
N$32  (via drill 0.51)
  Top 0.203: v20.93,53.65 9.55,53.65 7.11,51.21 5.69,51.21 J3.5.RINGNORM
  Bottom 0.203: v20.93,53.65 28.65,53.65 32.72,57.71 R17.1
N$33
  Bottom 0.203: J4.5.RINGNORM 5.69,40.23 5.69,48.77 18.49,61.57 18.49,63.2 25.4,70.1 32.72,70.1 R18.1
N$34
  Bottom 0.203: J5.5.RINGNORM 5.69,29.26 18.49,42.06 18.49,53.03 29.46,64.01 32.11,64.01 32.72,64.62 R19.1
NUDGELEFT  (via drill 0.51, 0.55)
  Top 0.203: v32.72,32.84 32.72,27.84 S2.4 | v61.98,60.35 62.59,60.35 68.07,65.84 68.07,68.28 67.87,68.48 67.87,68.89 65.02,71.73 v65.02,77.01 | v46.94,92.46 46.94,94.89 45.92,95.91 45.92,97.33 U2.21
  Bottom 0.203: v32.72,32.84 32.72,44.5 35.15,46.94 35.15,52.43 36.17,53.44 48.36,53.44 55.88,60.96 61.37,60.96 v61.98,60.35 | v65.02,77.01 62.99,79.05 55.68,79.05 47.14,87.58 47.14,92.25 v46.94,92.46
NUDGERIGHT  (via drill 0.51)
  Top 0.203: v47.95,84.53 47.14,83.72 47.14,83.52 45.11,81.48 45.11,81.35 44.45,80.69 44.45,77.81 | v45.11,92.46 44.7,92.86 43.89,92.86 43.08,92.05 42.27,92.05 41.86,92.46 41.86,94.28 43.48,95.91 43.48,97.33 U2.22 | S3.4 42.47,27.84 42.47,32.51 40.23,34.75 40.23,73.56 41.45,74.78 42.06,74.78 42.88,75.59 43.89,75.59 44.3,75.18 45.52,76.4 44.49,77.43 44.49,77.77 | 44.45,77.81 44.49,77.77 | 44.45,77.81 44.49,77.77
  Bottom 0.203: v47.95,84.53 47.95,85.55 44.91,88.59 44.91,92.25 v45.11,92.46
RESET  (via drill 0.51)
  Top 0.203: v70.31,34.34 81.28,45.31 81.28,48.77 80.67,49.38 79.05,49.38 U$1.IICRST
  Bottom 0.203: v70.31,34.34 70.31,23.98 65.63,19.3 B1.D5
SCL  (via drill 0.51)
  Top 0.203: v56.29,79.86 56.29,78.84 53.65,76.2 53.65,69.9 53.03,69.29 53.03,67.67 B1.A5 | v93.07,84.53 96.72,88.19 96.72,89.61 U1.12 | v66.85,60.35 76.2,51 76.2,47.14 U$1.SCL
  Bottom 0.203: v56.29,79.86 55.47,80.67 55.47,87.99 56.08,88.59 56.08,89.81 U2.12 | v93.07,84.53 93.07,79.25 91.44,77.62 91.44,57.3 79.86,45.72 77.62,45.72 76.4,46.94 U$1.SCL | v66.85,60.35 64.62,62.59 58.52,62.59 53.65,67.46 53.03,67.46 B1.A5
SDA  (via drill 0.51)
  Top 0.203: v62.79,77.22 v65.02,79.45 | v63.2,97.13 v64.41,98.35 | v67.06,58.93 73.97,52.02 73.97,47.14 U$1.SDA
  Bottom 0.203: v65.02,79.45 64.01,80.47 64.01,83.31 58.73,88.59 58.73,89.81 U2.13 58.52,90.02 57.91,90.63 57.91,93.47 58.32,93.88 59.94,93.88 v63.2,97.13 | v62.79,77.22 62.79,75.79 63.2,75.39 63.2,73.76 62.38,72.95 | 62.38,72.95 58.32,68.89 56.69,68.89 55.47,67.67 B1.A4 | v64.41,98.35 65.63,99.57 94.28,99.57 95.3,98.55 95.3,96.52 99.16,92.66 99.16,89.81 U1.13 | v67.06,58.93 67.06,59.33 67.67,59.94 67.67,67.67 62.38,72.95
START  (via drill 0.51)
  Top 0.203: v41.86,72.75 40.64,71.53 40.64,46.13 50.39,36.37 50.39,18.09 52.43,16.05 53.03,16.05 U$3.2
  Bottom 0.203: v41.86,72.75 42.06,72.54 44.7,72.54 51.21,79.05 51.21,79.86 50.6,80.47 47.14,80.47 46.33,79.65 46.33,78.84 43.48,76 37.39,76 27.03,86.36 27.03,90.83 27.84,91.64 28.65,91.64 29.26,91.03 29.26,87.17 30.28,86.16 31.9,86.16 34.34,88.59 34.34,92.66 38.2,96.52 38.2,97.33 U2.24
STOP  (via drill 0.51)
  Top 0.203: v30.68,86.97 30.68,86.36 23.57,79.25 23.57,55.07 21.34,52.83 19.71,52.83 18.09,51.21 18.09,45.31 30.28,33.12 30.28,24.38 37.8,16.87 37.8,16.05 U$4.2
  Bottom 0.203: v30.68,86.97 31.9,88.19 31.9,90.83 35.76,94.69 35.76,97.33 U2.25
SYNC_IN  (via drill 0.51)
  Top 0.203: v93.07,77.42 92.86,77.22 83.92,77.22 83.11,76.4 81.48,76.4 80.87,77.01 75.79,77.01 72.95,74.17 71.32,74.17 70.71,73.56 69.7,73.56 69.49,73.76 68.89,73.76 R22.2
  Bottom 0.203: v93.07,77.42 94.49,76 94.49,31.29 99.16,26.62 99.16,15.44 IC2.9
SYNC_IN_BUFFER  (via drill 0.51)
  Top 0.203: v73.15,16.66 70.71,19.1 B1.D7
  Bottom 0.203: v73.15,16.66 73.56,17.07 93.88,17.07 95.1,15.85 95.1,15.44 96.32,14.22 99.57,14.22 100.58,15.24 101.6,15.24 IC2.8
SYNC_OUT_CLK
  Bottom 0.203: IC3.2 10.36,10.97 11.38,10.97 18.09,17.68 49.38,17.68 52.43,20.73 61.57,20.73 62.99,19.3 B1.D4
SYNC_OUT_CLK_BUFFER  (via drill 0.51)
  Top 0.203: v55.47,50.8 55.47,52.63 68.48,65.63 68.48,68.89 69.9,70.31 69.9,70.92 69.09,71.73 68.28,71.73 68.07,71.53 67.87,71.53 66.45,72.95 66.45,84.73 68.07,86.36 68.68,86.36 R24.2
  Bottom 0.203: v55.47,50.8 54.66,50.8 34.95,31.09 28.65,31.09 16.87,19.3 16.87,18.9 9.14,11.18 9.14,10.57 9.96,9.75 10.77,9.75 11.79,10.77 12.8,10.77 IC3.3
SYNC_OUT_RUN
  Bottom 0.203: IC2.12 91.44,15.44 90.42,15.44 89.41,16.46 77.42,16.46 75.39,14.43 65.23,14.43 60.55,19.1 B1.D3
SYNC_OUT_RUN_BUFFER
  Bottom 0.203: IC2.11 94.28,15.24 94.28,11.79 98.15,7.92 98.15,6.91 92.86,1.63 3.05,1.63 1.22,3.45 1.22,4.06 2.03,4.88 11.38,4.88 12.39,3.86 R23.2
TEMPOTAP  (via drill 0.51)
  Top 0.203: v44.3,81.69 v41.66,84.33 | v49.78,72.75 49.78,58.93 54.25,54.46 54.25,49.58 v54.46,49.38
  Bottom 0.203: v41.66,84.33 39.01,84.33 34.75,88.59 34.75,92.46 37.19,94.89 38,94.89 40.44,97.33 40.84,97.33 U2.23 | v44.3,81.69 49.78,81.69 50.19,82.09 51,82.09 51.61,81.48 51.61,74.57 v49.78,72.75 | v54.46,49.38 58.32,49.38 75.18,32.51 75.18,20.52 75.79,19.91 75.79,18.69 74.57,17.48 69.9,17.48 68.48,16.05 U$2.2

### Text on the board
tPlace: USB / IN | USB / OUT | GATE / IN | MIDI / IN | CV1 / IN | MIDI / OUT | CV2 / IN | METRO / NOME | GATE / OUT | SYNC / IN | CV1 / OUT | SYNC / OUT | CV2 / OUT | SYNC / OUT | NUDGE | STOP | START | TAP